# Altium schematic sheet Power Supply.SchDoc
size 152 x 39 mm
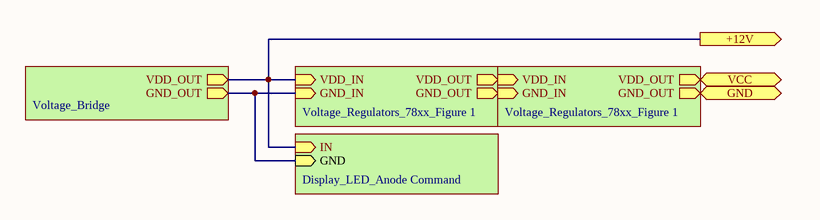
[diagram p0: Power Supply.SchDoc]

## Sub-sheets
U_Display_LED_Anode Command = Display_LED_Anode Command: GND (in), IN (in)
U_Power Supply_78xx = Voltage_Regulators_78xx_Figure 1: VDD_OUT (out), GND_IN (in), VDD_IN (in), GND_OUT (out)
U_Power Supply_78xx = Voltage_Regulators_78xx_Figure 1: VDD_OUT (out), GND_IN (in), VDD_IN (in), GND_OUT (out)
U_Voltage_Bridge = Voltage_Bridge: VDD_OUT (out), GND_OUT (out)

## Ports
+12V (out), GND (out), VCC (out)

## Nets
+12V: port +12V, sheet U_Power Supply_78xx/VDD_IN, sheet U_Voltage_Bridge/VDD_OUT, sheet U_Display_LED_Anode Command/IN
GND: port GND, sheet U_Power Supply_78xx/GND_OUT
VCC: port VCC, sheet U_Power Supply_78xx/VDD_OUT
(unnamed): sheet U_Power Supply_78xx/VDD_OUT, sheet U_Power Supply_78xx/VDD_IN
(unnamed): sheet U_Power Supply_78xx/GND_IN, sheet U_Voltage_Bridge/GND_OUT, sheet U_Display_LED_Anode Command/GND
(unnamed): sheet U_Power Supply_78xx/GND_OUT, sheet U_Power Supply_78xx/GND_IN